# Altium project Temperature_Station.PrjPcb
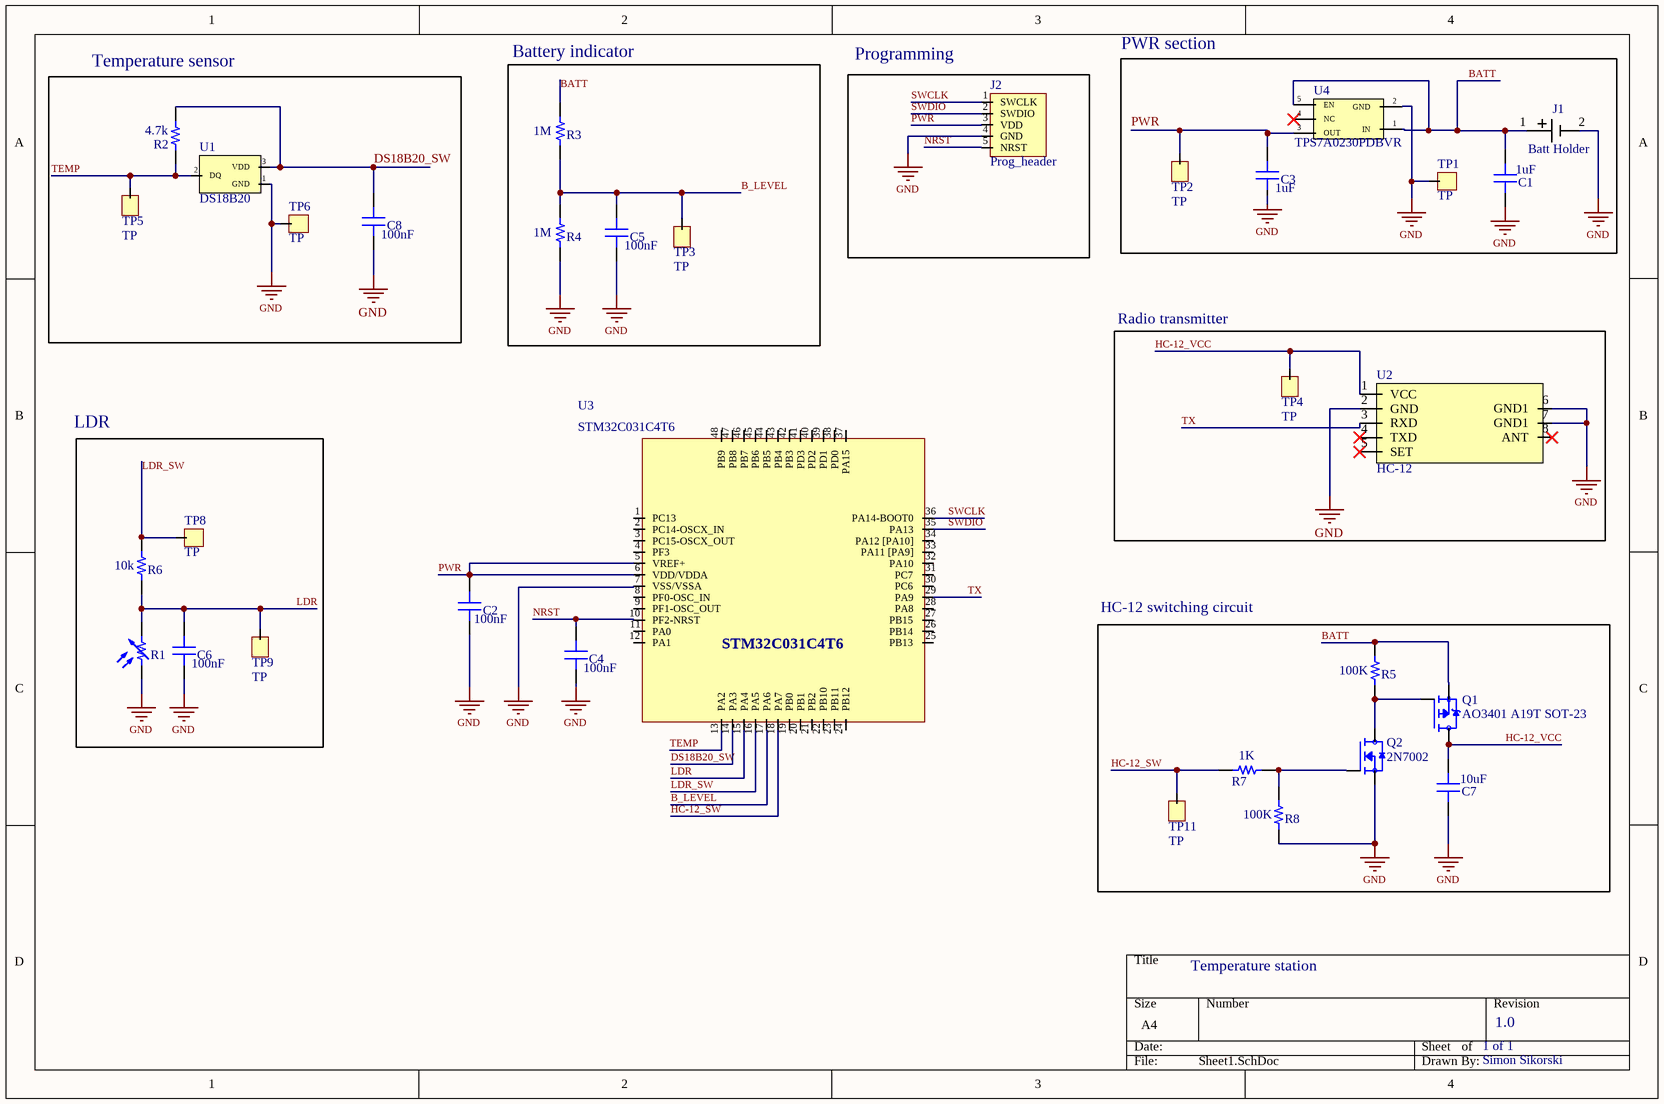
[diagram p0: Sheet1.SchDoc]
1 sheet, 33 parts. Net scope: global (net labels, ports and power ports of the same name join across sheets).
Board file: PCB1.PcbDoc

## Sheet Sheet1.SchDoc
size A4; SheetNumber: 1; SheetTotal: 1

### Parts
C1  1uF  [CAP 0805_2012]
C2  100nF  [CAP 0805_2012]
C3  1uF  [CAP 0805_2012]
C4  100nF  [CAP 0805_2012]
C5  100nF  [CAP 0805_2012]
C6  100nF  [CAP 0805_2012]
C7  10uF  [CAP 0805_2012]
C8  100nF  [CAP 0805_2012]
J1  Batt Holder  [21700_batt_holder]
J2  Prog_header  [Prog_header]
Q1  AO3401 A19T SOT-23  [AO3401 A19T SOT-23]
Q2  2N7002  [2N7002]
R1  NSL-19M51  [ADVANCED PHOTONIX NSL-19M51]  (value not drawn)
R2  4.7k  [RES 0603_1608]
R3  1M  [RES 0603_1608]
R4  1M  [RES 0603_1608]
R5  100K  [RES 0603_1608]
R6  10k  [RES 0603_1608]
R7  1K  [RES 0603_1608]
R8  100K  [RES 0603_1608]
TP1  TP  [TP]
TP2  TP  [TP]
TP3  TP  [TP]
TP4  TP  [TP]
TP5  TP  [TP]
TP6  TP  [TP]
TP8  TP  [TP]
TP9  TP  [TP]
TP11  TP  [TP]
U1  DS18B20  [DS18B20]
U2  HC-12  [HC-12]
U3  STM32C031C4T6  [QFP50P900X900X160-48N]
U4  TPS7A0230PDBVR  [TPS7A0230PDBVR]

### Blocks framed on the sheet
Temperature sensor: C8 R2 TP5 TP6 U1
Battery indicator: C5 R3 R4 TP3
Programming: J2
PWR section: C1 C3 J1 TP1 TP2 U4
Radio transmitter: TP4 U2
LDR: C6 R1 R6 TP8 TP9
HC-12 switching circuit: C7 Q1 Q2 R5 R7 R8 TP11

### Nets
GND: C1.1 C2.1 C3.1 C4.1 C5.1 C6.1 C7.1 C8.1 J1.2 J2.4(GND) Q2.2(S) R1.1 R4.1 R8.1 TP1.1 TP6.1 U1.1(GND) U2.2(GND) U2.6(GND1) U2.7(GND1) U3.7(VSS/VSSA) U4.2(GND)
B_LEVEL: C5.2 R3.1 R4.2 TP3.1 U3.17(PA6)
BATT: C1.2 J1.1 Q1.2(S) R3.2 R5.2 U4.1(IN) U4.5(EN)
DS18B20_SW: C8.2 R2.2 U1.3(VDD) U3.14(PA3)
HC-12_SW: R7.2 TP11.1 U3.18(PA7)
HC-12_VCC: C7.2 Q1.3(D) TP4.1 U2.1(VCC)
LDR: C6.2 R1.2 R6.1 TP9.1 U3.15(PA4)
LDR_SW: R6.2 TP8.1 U3.16(PA5)
NRST: C4.2 J2.5(NRST) U3.10(PF2-NRST)
PWR: C2.2 C3.2 J2.3(VDD) TP2.1 U3.5(VREF+) U3.6(VDD/VDDA) U4.3(OUT)
SWCLK: J2.1(SWCLK) U3.36(PA14-BOOT0)
SWDIO: J2.2(SWDIO) U3.35(PA13)
TEMP: R2.1 TP5.1 U1.2(DQ) U3.13(PA2)
TX: U2.3(RXD) U3.29(PA9)
NetQ1_1: Q1.1(G) Q2.3(D) R5.1
NetQ2_1: Q2.1(G) R7.1 R8.2

Not connected (* = marked no-connect by the designer): U2 4(TXD)* 5(SET)* 8(ANT)*; U3 1(PC13) 2(PC14-OSCX_IN) 3(PC15-OSCX_OUT) 4(PF3) 8(PF0-OSC_IN) 9(PF1-OSC_OUT) 11(PA0) 12(PA1) 19(PB0) 20(PB1) 21(PB2) 22(PB10) 23(PB11) 24(PB12) 25(PB13) 26(PB14) 27(PB15) 28(PA8) 30(PC6) 31(PC7) 32(PA10) 33(PA11_[PA9]) 34(PA12_[PA10]) 37(PA15) 38(PD0) 39(PD1) 40(PD2) 41(PD3) 42(PB3) 43(PB4) 44(PB5) 45(PB6) 46(PB7) 47(PB8) 48(PB9); U4 4(NC)*

### Notes on the sheet
- Temperature station
- 1 of 1
- 1.0
- Simon Sikorski

### Library data of the parts
C1-C8 = MM05ZC105KCZ2A: SMT Capacitor; manufacturer: AVX Corporation; Capacitance: 1µF; Temperature Coefficient: X7R; Tolerance: ±10%; value: 1µF; Voltage - Rated: 10V; Applications: Medical, Non-Critical; componentlink1description: Datasheet; componentlink1url: http://datasheets.avx.com/AVX-MM.pdf; componentlink2description: DigiKey Link; componentlink2url: http://digikey.com/product-detail/en/avx-corporation/MM05ZC105KCZ2A/478-10611-1-ND/7344872; Device Package: 0805 (2012 Metric); lastupdated: 02/09/2020 01:04:42; Lifecycle Status: Active; Part Number: MM05ZC105KCZ2A; Minimum Order: 1; Mounting Type: Surface Mount, MLCC; Operating Temperature: -55°C ~ 125°C; Package / Case: 0805 (2012 Metric); packaging: TapeAndReel; partid: 2439; Part Status: Active; price: 0.50; series: MM; Size / Dimension: 0.079" L x 0.049" W (2.01mm x 1.25mm); Supplier 1: DigiKey; Supplier Part Number 1: 478-10611-1-ND; Thickness (Max): 0.029" (0.74mm)
J1 = 21700_SingleCell: 21700 battery holder
Q1 = AO3401 A19T SOT-23: P-Channel MOSFET
Q2 = 2N7002: N-channel MOSFET
R1 = NSL-19M51: PHOTOCELL; Manufacturer: Advanced Photonix; Cell Resistance @ Illuminance: 20 ~ 100kOhms @ 10 lux; Cell Resistance (Min) @ Dark: 20 MOhms @ 10 s; Voltage - Max: 100Vpk; Wavelength: 550nm; ComponentLink1Description: Datasheet; ComponentLink1URL: https://lunainc.com/wp-content/uploads/2016/06/NSL-19M51.pdf; ComponentLink2Description: DigiKey Link; ComponentLink2URL: https://www.digikey.com/en/products/detail/advanced-photonix/NSL-19M51/5039794; Device Package: Radial; LastUpdated: 03/03/2022 12:53:42; Lifecycle Status: Active; Part Number: NSL-19M51; Minimum Order: 1; Mounting Type: Through Hole; Operating Temperature: -60°C ~ 75°C (TA); Package / Case: Radial; Packaging: Bulk; Part Status: Active; Price: 0.61; Series: -; Supplier 1: DigiKey; Supplier Part Number 1: NSL-19M51-ND; Supplier Device Package: TO-18
R2-R8 = RNCS0603BKE49K9: RES 49.9K OHM 0.1% 1/16W 0603; Manufacturer: Stackpole Electronics Inc; Power (Watts): 0.063W, 1/16W; Resistance: 49.9 kOhms; Temperature Coefficient: ±25ppm/°C; Value: 49.9 kOhms; ComponentLink1Description: Datasheet; ComponentLink1URL: https://www.seielect.com/catalog/sei-rncs_rnch.pdf; ComponentLink2Description: DigiKey Link; ComponentLink2URL: https://www.digikey.com/en/products/detail/stackpole-electronics-inc/RNCS0603BKE49K9/1800040; Composition: Thin Film; Device Package: 0603 (1608 Metric); Features: Anti-Corrosive, Automotive AEC-Q200, Moisture Resistant; Height - Seated (Max): 0.022" (0.55mm); LastUpdated: 09/02/2024 20:43:37; Lifecycle Status: Active; Part Number: RNCS0603BKE49K9; Minimum Order: 1; Number of Terminations: 2; Operating Temperature: -55°C ~ 155°C; Package / Case: 0603 (1608 Metric); Packaging: TapeAndReel; PartId: 4842; Part Status: Active; Price: 0.06; Ratings: AEC-Q200; Series: RNCS; Size / Dimension: 0.061" L x 0.031" W (1.55mm x 0.80mm); Supplier 1: DigiKey; Supplier Part Number 1: RNCS0603BKE49K9CT-ND; Supplier Device Package: 0603; Tolerance: ±0.1%
U1 = DS18B20: Temp senspr sealed detached.
U3 = STM32C031C4T6: MCU